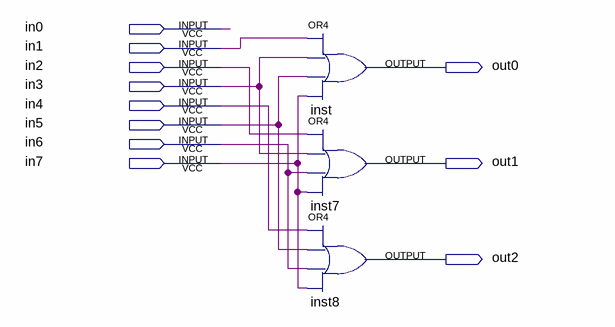
[diagram p0: schematic sheet]
// Quartus schematic coder.bdf as structural Verilog: 3 symbols, 11 pins
module coder (
  input  in0,
  input  in1,
  input  in2,
  input  in3,
  input  in4,
  input  in5,
  input  in6,
  input  in7,
  output out0,
  output out1,
  output out2
);

  or inst (out0, in1, in3, in5, in7);
  or inst7 (out1, in2, in3, in6, in7);
  or inst8 (out2, in4, in5, in6, in7);
endmodule
